# EAGLE design untitled (EAGLE 5.11)
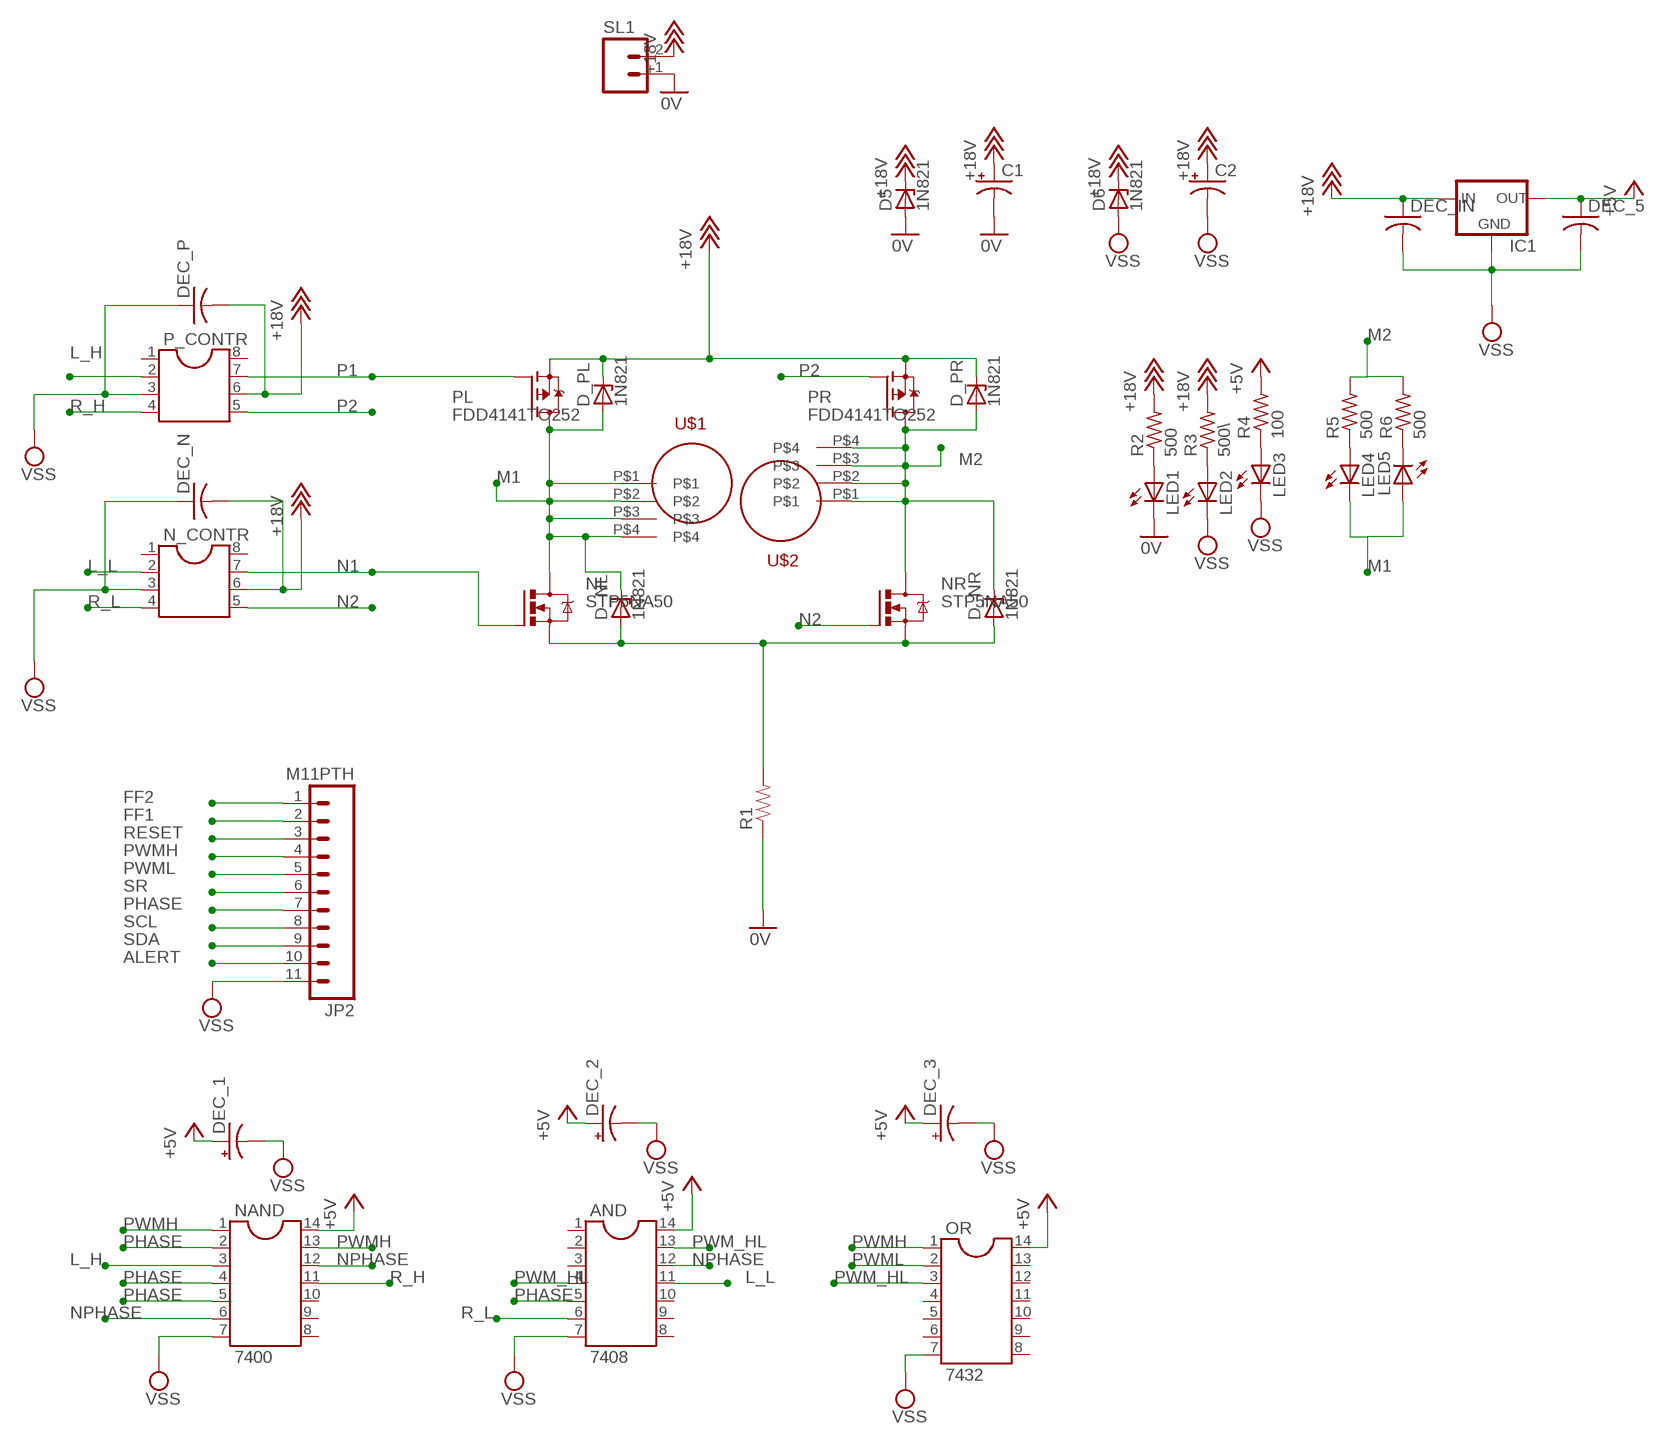
[diagram p0: schematic, sheet 1]

## Parts
AND  7408  DIL14S  [SOCKET-14]
C1  CAP_POLPTH3  [CPOL-RADIAL-1000UF-63V]
C2  CAP_POLPTH3  [CPOL-RADIAL-1000UF-63V]
D5  1N821  [DO35Z10]
D6  1N821  [DO35Z10]
D_NL  1N821  [DO35Z10]
D_NR  1N821  [DO35Z10]
D_PL  1N821  [DO35Z10]
D_PR  1N821  [DO35Z10]
DEC_1  CAP_POLPTH1  [CPOL-RADIAL-100UF-25V]
DEC_2  CAP_POLPTH1  [CPOL-RADIAL-100UF-25V]
DEC_3  CAP_POLPTH1  [CPOL-RADIAL-100UF-25V]
DEC_5  C-USC0805  [C0805]
DEC_IN  C-USC0805  [C0805]
DEC_N  C-USC0805  [C0805]
DEC_P  C-USC0805  [C0805]
IC1  V_REG_78XXSIDE  [78XXL]
JP2  M11PTH  [1X11]
LED1  LED5MM  [LED5MM]
LED2  LED5MM  [LED5MM]
LED3  LED5MM  [LED5MM]
LED4  LED5MM  [LED5MM]
LED5  LED5MM  [LED5MM]
N_CONTR  DIL8S  [SOCKET-08]
NAND  7400  DIL14S  [SOCKET-14]
NL  STP5NA50  [TO220BV]
NR  STP5NA50  [TO220BV]
OR  7432  DIL14S  [SOCKET-14]
P_CONTR  DIL8S  [SOCKET-08]
PL  FDD4141TO252  [TO252]
PR  FDD4141TO252  [TO252]
R1  RESISTOR1206  [1206]
R2  500  R-US_R0805  [R0805]
R3  500\  R-US_R0805  [R0805]
R4  100  R-US_R0805  [R0805]
R5  500  R-US_R0805  [R0805]
R6  500  R-US_R0805  [R0805]
SL1  M02  [02P]
U$1  SCREW_TERMINAL  [SCREW_TERMINAL_7693]
U$2  SCREW_TERMINAL  [SCREW_TERMINAL_7693]

## Nets
0V: C1.2(-) D5.A LED1.K(C) R1.1 SL1.1
+5V: AND.14 DEC_1.1(+) DEC_2.1(+) DEC_3.1(+) DEC_5.1 IC1.OUT NAND.14 OR.14 R4.2
+18V: C1.1(+) C2.1(+) D5.C D6.C D_PL.C D_PR.C DEC_IN.1 DEC_N.2 DEC_P.2 IC1.IN N_CONTR.6 P_CONTR.6 PL.3(S) PR.3(S) R2.2 R3.2 SL1.2
ALERT: JP2.10
FF1: JP2.2
FF2: JP2.1
L_H: NAND.3 P_CONTR.2
L_L: AND.11 N_CONTR.2
M1: D_NL.C D_PL.A LED4.K(C) LED5.A NL.D PL.2(D) U$1.P$1 U$1.P$2 U$1.P$3 U$1.P$4
M2: D_NR.C D_PR.A NR.D PR.2(D) R5.2 R6.2 U$2.P$1 U$2.P$2 U$2.P$3 U$2.P$4
N1: N_CONTR.7 NL.G
N2: N_CONTR.5 NR.G
N$1: LED4.A R5.1
N$2: LED1.A R2.1
N$3: LED2.A R3.1
N$4: LED5.K(C) R6.1
N$5: LED3.A R4.1
N$15: D_NL.A D_NR.A NL.S NR.S R1.2
NPHASE: AND.12 NAND.6 NAND.12
P1: P_CONTR.7 PL.1(G)
P2: P_CONTR.5 PR.1(G)
PHASE: AND.5 JP2.7 NAND.2 NAND.4 NAND.5
PWM_HL: AND.4 AND.13 OR.3
PWMH: JP2.4 NAND.1 NAND.13 OR.1
PWML: JP2.5 OR.2
R_H: NAND.11 P_CONTR.4
R_L: AND.6 N_CONTR.4
RESET: JP2.3
SCL: JP2.8
SDA: JP2.9
SR: JP2.6
VSS: AND.7 C2.2(-) D6.A DEC_1.2(-) DEC_2.2(-) DEC_3.2(-) DEC_5.2 DEC_IN.2 DEC_N.1 DEC_P.1 IC1.GND JP2.11 LED2.K(C) LED3.K(C) N_CONTR.3 NAND.7 OR.7 P_CONTR.3
Unconnected: AND.1 AND.2 AND.3 AND.8 AND.9 AND.10 N_CONTR.1 N_CONTR.8 NAND.8 NAND.9 NAND.10 OR.4 OR.5 OR.6 OR.8 OR.9 OR.10 OR.11 OR.12 OR.13 P_CONTR.1 P_CONTR.8

## Library data of the parts
AND NAND OR = ic-package:DIL14: Dual In Line / Socket
C1 C2 DEC_1-DEC_3 = SparkFun:CAP_POL: Capacitor Polarized These are standard SMD and PTH capacitors. Normally 10uF, 47uF, and 100uF in electrolytic and tantalum varieties. Always verify the external diameter of the through hole cap, it varies with capacity, voltage, and manufacturer. The EIA devices should be standard.
D5 D6 D_NL D_NR D_PL D_PR = diode:1N821: Reference DIODE temperature compensated, 6,2 V
DEC_5 DEC_IN DEC_N DEC_P = resistor:C-US: CAPACITOR, American symbol
IC1 = SparkFun:V_REG_78XX: Voltage Regulator Standard 7805 5V regulator. IGO (Input Ground Output). Spark Fun Electronics SKU : COM-00107
JP2 = SparkFun:M11: Header 11 Standard 11-pin 0.1" header. Use with straight break away headers (SKU : PRT-00116), right angle break away headers (PRT-00553), swiss pins (PRT-00743), machine pins (PRT-00117), and female headers (PRT-00115).
LED1-LED5 = SparkFun:LED: LEDs Standard schematic elements and footprints for 5mm, 3mm, 1206, and 0603 sized LEDs. 5mm - Spark Fun Electronics SKU : COM-00529 (and others)
N_CONTR P_CONTR = ic-package:DIL8: Dual In Line / Socket
NL NR = transistor-power:STP5NA50: N-CHANNEL MOS FET
PL PR = transistor-fet:FDD4141: P-Channel PowerTrench® MOSFET Source: FDD4141.pdf
R1 = SparkFun:RESISTOR: Resistor Basic schematic elements and footprints for 0603, 1206, and PTH resistors.
R2-R6 = rcl:R-US_: RESISTOR, American symbol
SL1 = con-amp-quick:M02: AMP QUICK CONNECTOR
U$1 U$2 = chlk_bot:SCREW_TERMINAL

## Board
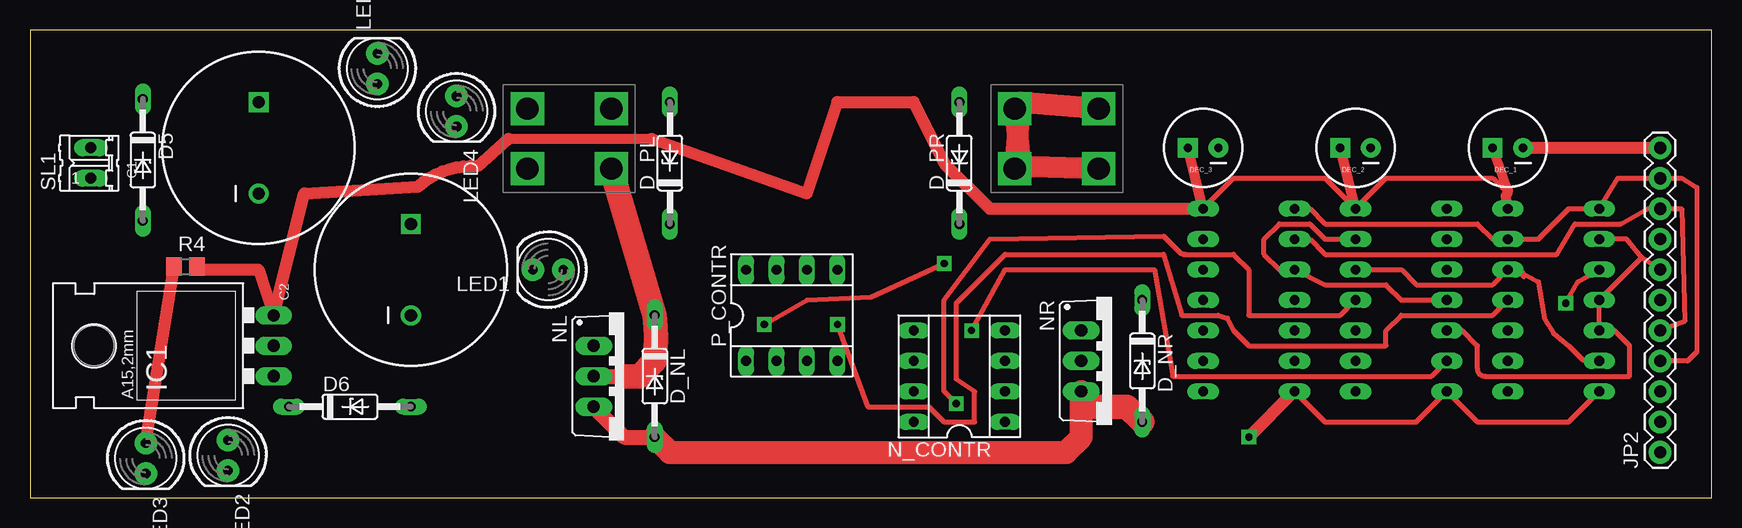
[diagram p1: board, top side]
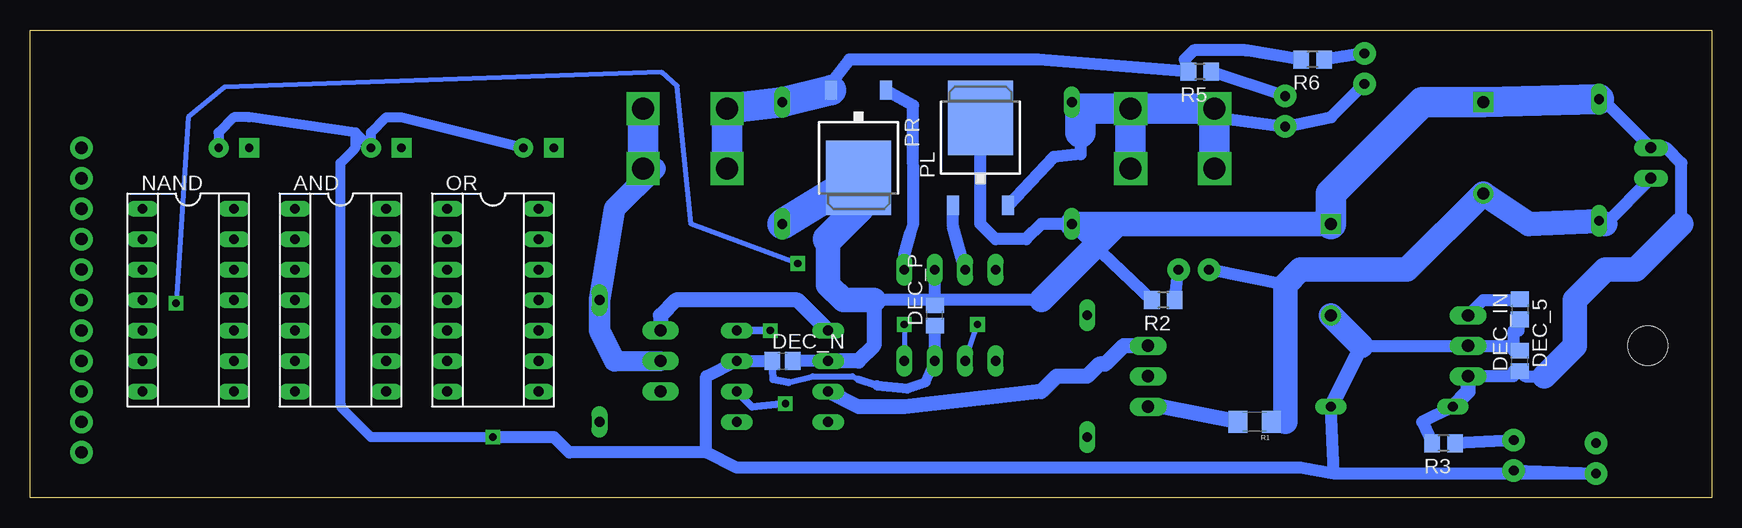
[diagram p2: board, bottom side, seen from below]

Size 140.19 x 39.04 mm. Coordinates in mm from the lower left corner, seen from the top.
Outline: 0,0 140.19,0 140.19,39.04 0,39.04 0,0
Copper layers (1*16): Top 0.035mm / dielectric 1.5mm / Bottom 0.035mm
Design rules "MWSEagleDesignRules": minimum track width 16mil, minimum drill 24mil, track to track 13mil, track to pad 13mil, pad to pad 13mil, via to via 13mil, smd to smd 8mil, copper to edge 40mil, drill to drill 8mil, minimum pad ring 10mil, minimum via ring 8mil, stop-mask expansion 4mil, vias tented up to drill 0mil, thermal gap 10mil

### Footprints (pad centres in the part's own frame; a part is rotated, then mirrored left to right if it is on the bottom)
SOCKET-14 = drill 0.813 long: 1 -7.62,-3.81; 2 -5.08,-3.81; 3 -2.54,-3.81; 4 0,-3.81; 5 2.54,-3.81; 6 5.08,-3.81; 7 7.62,-3.81; 8 7.62,3.81; 9 5.08,3.81; 10 2.54,3.81; 11 0,3.81; 12 -2.54,3.81; 13 -5.08,3.81; 14 -7.62,3.81
CPOL-RADIAL-1000UF-63V = drill 1.016 pad 1.651 square: 1 3.81,0 | drill 1.016 pad 1.676 round: 2 -3.81,0
DO35Z10 = drill 0.813 long: A 5.08,0; C -5.08,0
CPOL-RADIAL-100UF-25V = drill 0.7 pad 1.651 square: 1 1.27,0 | drill 0.7 pad 1.651 round: 2 -1.27,0
C0805 = smd 1.3 x 1.5: 1 -0.85,0; 2 0.85,0
78XXL = drill 1.016 long: GND 0,-3.81; IN -2.54,-3.81; OUT 2.54,-3.81 | hole 3.302: 0,11.176
1X11 = drill 1.016 pad 1.88 round: 1 0,0; 2 2.54,0; 3 5.08,0; 4 7.62,0; 5 10.16,0; 6 12.7,0; 7 15.24,0; 8 17.78,0; 9 20.32,0; 10 22.86,0; 11 25.4,0
LED5MM = drill 0.813 pad 1.88 round: A -1.27,0; K 1.27,0
SOCKET-08 = drill 0.813 long: 1 -3.81,-3.81; 2 -1.27,-3.81; 3 1.27,-3.81; 4 3.81,-3.81; 5 3.81,3.81; 6 1.27,3.81; 7 -1.27,3.81; 8 -3.81,3.81
TO220BV = drill 1.016 long: D 0,-2.54; G -2.54,-2.54; S 2.54,-2.54
TO252 = smd 1 x 1.6: 1 -2.28,-4.8; 2 2.28,-4.8 | smd 5.4 x 6.2: 3 0,2.5
1206 = smd 1.6 x 1.8: 1 -1.4,0; 2 1.4,0
R0805 = smd 1.3 x 1.5: 1 -0.95,0; 2 0.95,0
02P = drill 0.914 long: 1 -1.27,0; 2 1.27,0
SCREW_TERMINAL_7693 = drill 1.85 square: P$1 -3,2; P$2 -3,-3; P$3 4,-3; P$4 4,2

### Placement (x,y rotation side)
AND  114.3,16.51 270 bottom
C1  19.05,29.21 90 top
C2  31.75,19.05 90 top
D5  9.4,28.19 270 top
D6  26.67,7.62 0 top
D_NL  52.07,10.16 270 top
D_NR  92.71,11.43 270 top
D_PL  53.34,27.94 90 top
D_PR  77.47,27.94 90 top
DEC_1  123.19,29.21 180 top
DEC_2  110.49,29.21 180 top
DEC_3  97.79,29.21 180 top
DEC_5  16,15.75 270 bottom
DEC_IN  16,11.43 90 bottom
DEC_N  77.47,11.43 0 bottom
DEC_P  64.77,15.24 90 bottom
IC1  16.51,12.7 90 top
JP2  135.89,3.81 90 top
LED1  43.18,19.05 180 top
LED2  16.51,3.56 270 top
LED3  9.65,3.3 270 top
LED4  35.56,32.26 270 top
LED5  28.96,35.81 90 top
N_CONTR  77.47,10.16 90 top
NAND  127,16.51 270 bottom
NL  49.53,10.16 270 top
NR  90.17,11.43 270 top
OR  101.6,16.51 270 bottom
P_CONTR  63.5,15.24 0 top
PL  60.96,29.21 0 bottom
PR  71.12,29.21 180 bottom
R1  38.1,6.35 180 bottom
R2  45.72,16.51 180 bottom
R3  22.35,4.57 180 bottom
R4  12.95,19.3 0 top
R5  42.67,35.56 180 bottom
R6  33.27,36.58 180 bottom
SL1  5.08,27.94 90 top
U$1  44.45,30.48 0 top
U$2  85.09,30.48 0 top

### Tracks (layer width: path | path; a pad name or v marks a point on that pad's centre or on a via)
0V
  Bottom 0.406: 35.56,6.35 R1.1 36.83,6.35
  Bottom 1.016: SL1.1 8.89,22.86 | 35.56,17.78 LED1.K
  Bottom 2.032: 8.89,22.86 D5.A 15.24,22.86 C1.2 25.4,19.05 34.29,19.05 35.56,17.78 35.56,6.35
+5V
  Top 0.406: OR.14 100.33,26.67 107.95,26.67 AND.14 113.03,26.67 121.92,26.67 123.19,25.4 NAND.14
  Top 0.813: 39.88,29.97 51.82,29.97 | OR.14 DEC_3.1 | AND.14 DEC_2.1 | DEC_1.1 123.19,25.66 arc-45 123,25.21 NAND.14
  Top 1.016: OR.14 80.01,24.13 76.2,27.94 73.66,33.02 67.31,33.02 64.77,25.4 51.82,29.97 | 39.88,29.97 37.34,27.7 arc45 32.33,25.98 22.86,25.4 IC1.OUT 19.05,19.05 13.97,19.05 R4.2
  Bottom 1.016: IC1.OUT 19.05,16.51 16,16.51 DEC_5.1
+18V
  Bottom 1.016: D5.C 8.89,33.02 SL1.2 3.81,29.21 2.54,27.94 2.54,22.86 | IC1.IN 16.51,10.16 16.51,10.58 DEC_IN.1 15.58,10.16 13.97,10.16 | 64.77,16.51 DEC_P.2 | N_CONTR.6 DEC_N.2 | PL.3 60.96,22.86 59.69,21.59 57.15,21.59 55.88,22.86 D_PL.C R2.2 | 64.77,16.51 P_CONTR.6 | 55.88,16.51 64.77,16.51 | 71.12,24.13 PR.3 | 64.77,16.51 69.85,16.51 | R3.2 24.13,6.35 D6.C
  Bottom 1.27: N_CONTR.6 71.12,11.43 69.85,12.7 69.85,16.51 | D6.C 20.32,8.89 IC1.IN
  Bottom 2.032: 2.54,22.86 6.35,19.05 8.89,19.05 11.43,16.51 11.43,12.7 13.97,10.16 | C2.1 49.53,22.86 | 49.53,22.86 D_PL.C | 49.53,22.86 55.88,16.51 | 73.66,21.59 73.66,17.78 72.39,16.51 69.85,16.51
  Bottom 2.54: D5.C C1.1 24.13,33.02 31.75,25.4 C2.1 | PR.3 D_PR.C | 73.66,21.59 71.12,24.13
L_H  (via drill 0.61)
  Top 0.406: NAND.3 129.03,18.03 v128.02,16.26 | v76.2,19.56 70.1,16.76 64.77,16.51 v61.21,14.48
  Bottom 0.406: v128.02,16.26 127,31.75 123.95,34.29 87.55,35.51 86.24,34.37 85.09,22.86 v76.2,19.56 | P_CONTR.2 v61.21,14.48
L_L  (via drill 0.61)
  Top 0.406: AND.11 109.22,15.24 101.6,15.24 101.6,19.05 100.33,20.32 96.27,20.32 arc-45 95.83,20.51 94.49,21.84 80.01,21.59 76.2,16.51 76.2,8.89 v77.22,7.87
  Bottom 0.61: v77.22,7.87 80.01,7.62 N_CONTR.2
M1
  Top 1.27: NL.D 49.53,10.16
  Top 2.032: U$1.P$3 D_NL.C arc-13 52.07,11.43 50.8,10.16 49.53,10.16
  Bottom 1.016: 52.61,32.48 D_PL.A | 52.61,30.48 52.61,28.67 54.86,28.45 PL.2 | LED5.A 31.75,31.75 LED4.K 41.45,31.75
  Bottom 2.54: U$1.P$2 41.45,31.75 U$1.P$1 U$1.P$4 | U$1.P$3 U$1.P$4 | U$1.P$4 52.61,32.48 52.61,30.48
M2
  Top 1.778: U$2.P$1 82.55,27.94 | U$2.P$2 82.55,33.02 U$2.P$4 | U$2.P$3 82.04,27.69
  Bottom 1.016: U$2.P$2 82.55,26.67 | R6.2 38.86,37.34 43.18,37.34 43.94,36.58 R5.2 56.13,36.58 71.88,36.58 73.66,34.29 D_PR.A
  Bottom 1.676: 91.44,11.43 NR.D
  Bottom 1.778: 91.44,11.43 92.71,13.97 D_NR.C 91.44,24.13 88.09,27.48 U$2.P$3
  Bottom 2.54: U$2.P$4 U$2.P$3 | U$2.P$2 U$2.P$1 D_PR.A PR.2
N1
  Bottom 1.27: NL.G 49.02,12.7 50.55,11.18 51.05,11.18 52.07,10.16 54.61,10.16 55.88,8.89 67.31,7.62 71.12,7.62 N_CONTR.7
N2
  Bottom 1.27: N_CONTR.5 76.2,16.51 86.36,16.51 87.63,15.24 NR.G
N$1
  Bottom 1.016: LED4.A R5.1
N$2
  Bottom 1.016: R2.1 LED1.A
N$3
  Bottom 1.016: LED2.A R3.1
N$4
  Bottom 1.016: LED5.K R6.1
N$5
  Top 1.016: LED3.A R4.1
N$15
  Top 1.27: NL.S 49.53,5.08 D_NL.A | NR.S 88.9,7.62
  Top 1.93: NR.S 87.63,5.08 86.36,3.81 53.34,3.81 D_NL.A
  Top 2.032: D_NR.A 91.44,7.62 88.9,7.62
  Bottom 1.27: R1.2 45.85,7.62 NL.S
NPHASE
  Top 0.406: AND.12 114.3,19.05 115.57,17.78 121.92,17.78 NAND.12 124.02,18.98 | NAND.6 129.8,11.43 arc-45 129.35,11.62 128.27,12.7 127,13.71 126.24,14.99 125.73,18.03 124.02,18.98 | 124.53,18.47 124.21,18.8 124.47,18.8 arc-45 124.02,18.98
P1
  Bottom 1.016: P_CONTR.7 63.25,22.63 PL.1
P2
  Bottom 1.016: PR.1 66.58,32.77 66.55,22.86 66.8,22.1 67.31,20.32 P_CONTR.5
PHASE
  Top 0.406: AND.5 119.38,13.97 120.65,12.7 120.65,10.8 arc90 121.28,10.16 133.35,10.16 133.35,12.7 132.08,13.97 NAND.5 NAND.4 134.37,20.07 | NAND.2 133.1,21.59 134.37,20.07 | 134.37,20.07 JP2.7
PWM_HL
  Top 0.406: AND.13 107.95,21.59 106.68,22.86 104.14,22.86 102.87,21.59 102.87,20.32 104.14,19.05 OR.3 107.95,17.78 113.03,17.78 114.3,16.51 AND.4
PWMH
  Top 0.406: OR.1 106.68,24.13 107.95,22.86 120.65,22.86 121.92,21.59 NAND.13 125.73,21.59 128.27,24.13 NAND.1 132.33,26.67 137.67,26.67 138.94,25.91 138.94,12.19 138.18,11.43 JP2.4
PWML
  Top 0.406: OR.2 106.68,21.59 107.95,20.32 127.25,20.32 128.78,22.86 132.59,22.86 134.87,24.13 137.67,24.13 137.92,14.73 JP2.5
R_H  (via drill 0.61)
  Top 0.406: NAND.11 121.92,15.24 114.3,15.24 113.03,13.97 113.03,12.7 101.6,12.7 100.33,13.97 99.82,14.99 99.06,15.24 96.01,15.24 94.49,20.32 81.28,20.32 77.22,16.26 77.22,9.91 78.74,8.89 78.74,6.35 76.2,6.35 74.93,7.62 69.85,7.62 v67.31,14.48
  Bottom 0.406: v67.31,14.48 P_CONTR.4
R_L  (via drill 0.61)
  Top 0.406: AND.6 116.84,10.16 95.25,10.16 93.73,19.05 81.28,19.05 v78.49,13.97
  Bottom 0.61: v78.49,13.97 N_CONTR.4
VSS  (via drill 0.61)
  Top 0.406: NAND.7 128.27,6.35 120.65,6.35 AND.7 115.57,6.35 107.95,6.35 OR.7
  Top 1.016: v101.6,5.08 OR.7 | DEC_1.2 JP2.11
  Bottom 0.508: 71.12,9.91 71.63,10.16 74.93,10.16 76.96,9.65
  Bottom 0.61: 71.12,9.91 69.6,9.4 | 76.96,9.65 78.23,9.91 DEC_N.1
  Bottom 0.813: P_CONTR.3 65.53,9.65 67.06,9.14 69.6,9.4 | DEC_3.2 109.22,31.75 110.49,31.75 111.76,30.48 DEC_2.2 113.03,30.48 | 113.03,30.48 121.92,31.75 123.19,31.75 124.46,30.48 DEC_1.2 | 113.03,30.48 113.03,29.47 arc45 113.22,29.02 114.3,27.94 114.3,7.88 arc-45 114.11,7.43 111.76,5.08 v101.6,5.08
  Bottom 1.016: DEC_5.2 16.09,13.97 16.51,13.97 16.51,12.7 | 16.51,12.7 IC1.GND 29.21,12.7 | 16.51,12.7 16.51,12.28 DEC_IN.2 | P_CONTR.3 DEC_P.1 | DEC_N.1 N_CONTR.3 83.82,10.16 83.82,3.81 | 31.5,2.03 D6.A | 31.5,2.03 34.29,2.54 81.28,2.54 83.82,3.81 | v101.6,5.08 96.52,5.08 95.25,3.81 83.82,3.81 | 31.5,2.03 LED3.K LED2.K
  Bottom 1.27: D6.A 29.21,12.7
  Bottom 2.032: 29.21,12.7 C2.2